# Altium schematic sheet 10_HDMI_OUT.SchDoc
size A3
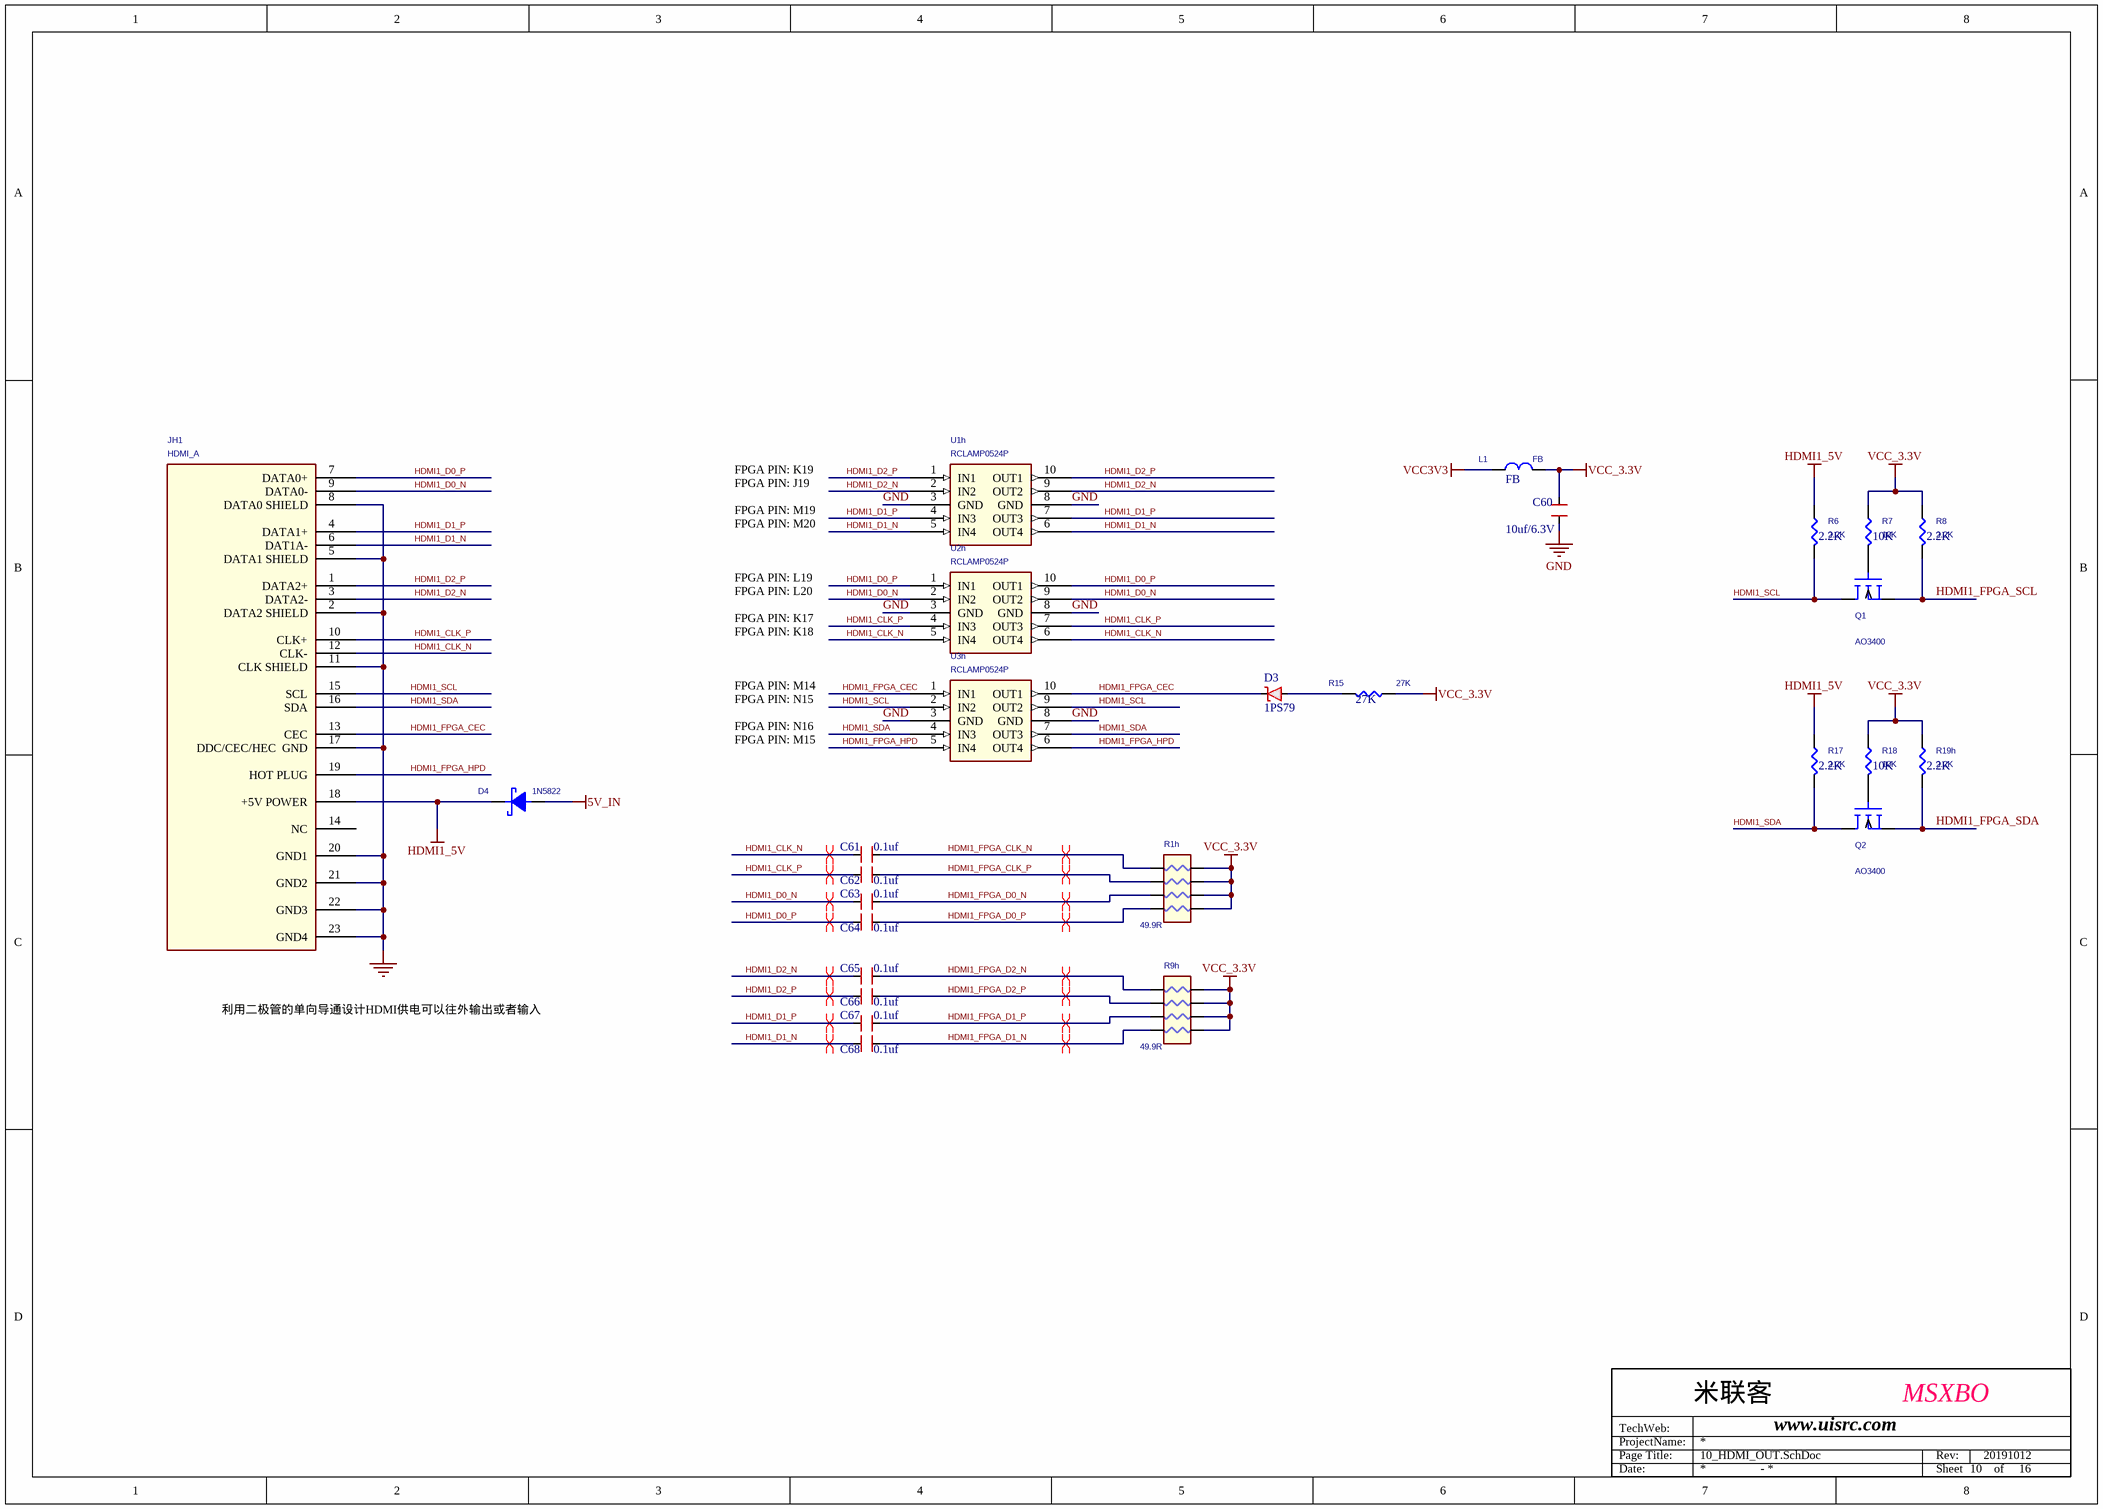
[diagram p0: 10_HDMI_OUT.SchDoc]

## Parts
C60  10uf/6.3V  [CAP0805]
C61  0.1uf  [CAP0402]
C62  0.1uf  [CAP0402]
C63  0.1uf  [CAP0402]
C64  0.1uf  [CAP0402]
C65  0.1uf  [CAP0402]
C66  0.1uf  [CAP0402]
C67  0.1uf  [CAP0402]
C68  0.1uf  [CAP0402]
D3  1PS79  [SOD-523]
D4  1N5822  [SMA_DO_214AC]
JH1  HDMI_A  [HDMI_1903015]
L1  FB  [CAP0603]
Q1  AO3400  [SOT23]
Q2  AO3400  [SOT23]
R1h  49.9R  [RA4_0603]
R6  2.2K  [RES0402]
R7  10K  [RES0402]
R8  2.2K  [RES0402]
R9h  49.9R  [RA4_0603]
R15  27K  [RES0402]
R17  2.2K  [RES0402]
R18  10K  [RES0402]
R19h  2.2K  [RES0402]
U1h  RCLAMP0524P  [SLP2510P8_10]
U2h  RCLAMP0524P  [SLP2510P8_10]
U3h  RCLAMP0524P  [SLP2510P8_10]

## Nets
5V_IN: D4.1(A)
GND: C60.2 JH1.2(DATA2_SHIELD) JH1.5(DATA1_SHIELD) JH1.8(DATA0_SHIELD) JH1.11(CLK_SHIELD) JH1.17(DDC/CEC/HEC__GND) JH1.20(GND1) JH1.21(GND2) JH1.22(GND3) JH1.23(GND4) U1h.3(GND) U1h.8(GND) U2h.3(GND) U2h.8(GND) U3h.3(GND) U3h.8(GND)
HDMI1_5V: D4.2(C) JH1.18(+5V_POWER) R6.2 R17.2
VCC3V3: L1.1
VCC_3.3V: C60.1 L1.2 R1h.1 R1h.2 R1h.3 R1h.4 R7.2 R8.2 R9h.1 R9h.2 R9h.3 R9h.4 R15.2 R18.2 R19h.2
HDMI1_CLK_N: C61.1 JH1.12(CLK-) U2h.5(IN4) U2h.6(OUT4)
HDMI1_CLK_P: C62.1 JH1.10(CLK+) U2h.4(IN3) U2h.7(OUT3)
HDMI1_D0_N: C63.1 JH1.9(DATA0-) U2h.2(IN2) U2h.9(OUT2)
HDMI1_D0_P: C64.1 JH1.7(DATA0+) U2h.1(IN1) U2h.10(OUT1)
HDMI1_D1_N: C68.1 JH1.6(DAT1A-) U1h.5(IN4) U1h.6(OUT4)
HDMI1_D1_P: C67.1 JH1.4(DATA1+) U1h.4(IN3) U1h.7(OUT3)
HDMI1_D2_N: C65.1 JH1.3(DATA2-) U1h.2(IN2) U1h.9(OUT2)
HDMI1_D2_P: C66.1 JH1.1(DATA2+) U1h.1(IN1) U1h.10(OUT1)
HDMI1_FPGA_CEC: D3.K JH1.13(CEC) U3h.1(IN1) U3h.10(OUT1)
HDMI1_FPGA_CLK_N: C61.2 R1h.8
HDMI1_FPGA_CLK_P: C62.2 R1h.7
HDMI1_FPGA_D0_N: C63.2 R1h.6
HDMI1_FPGA_D0_P: C64.2 R1h.5
HDMI1_FPGA_D1_N: C68.2 R9h.5
HDMI1_FPGA_D1_P: C67.2 R9h.6
HDMI1_FPGA_D2_N: C65.2 R9h.8
HDMI1_FPGA_D2_P: C66.2 R9h.7
HDMI1_FPGA_HPD: JH1.19(HOT_PLUG) U3h.5(IN4) U3h.6(OUT4)
HDMI1_FPGA_SCL: Q1.2(S) R8.1
HDMI1_FPGA_SDA: Q2.2(S) R19h.1
HDMI1_SCL: JH1.15(SCL) Q1.3(D) R6.1 U3h.2(IN2) U3h.9(OUT2)
HDMI1_SDA: JH1.16(SDA) Q2.3(D) R17.1 U3h.4(IN3) U3h.7(OUT3)
NetD3_A: D3.A R15.1
NetQ1_1: Q1.1(G) R7.1
NetQ2_1: Q2.1(G) R18.1

Not connected (* = marked no-connect by the designer): JH1 14(NC)

## Layout directives
differential pair: HDMI1_CLK_N, HDMI1_CLK_P, HDMI1_D0_N, HDMI1_D0_P, HDMI1_D1_N, HDMI1_D1_P, HDMI1_D2_N, HDMI1_D2_P, HDMI1_FPGA_CLK_N, HDMI1_FPGA_CLK_P, HDMI1_FPGA_D0_N, HDMI1_FPGA_D0_P, HDMI1_FPGA_D1_N, HDMI1_FPGA_D1_P, HDMI1_FPGA_D2_N, HDMI1_FPGA_D2_P

## Notes on the sheet
- FPGA PIN: K19
- FPGA PIN: J19
- FPGA PIN: M19
- FPGA PIN: M20
- FPGA PIN: L19
- FPGA PIN: L20
- FPGA PIN: K17
- FPGA PIN: K18
- FPGA PIN: M14
- FPGA PIN: N15
- FPGA PIN: N16
- FPGA PIN: M15
- 利用二极管的单向导通设计HDMI供电可以往外输出或者输入
- ProjectName:
- TechWeb:
- Page Title:
- 米联客
- www.uisrc.com
- MSXBO
- Rev:
- 20191012
- Date:
- -
- Sheet
- 10    of     16

## Library data of the parts
C60 = CAPACITOR: Generic Capacitor; Value: 4.7uF; DPN: *; Manufacturer: *
C61-C68 = C0402
D3 = DIODE-SCH: Schotkey Diode NOT GENERIC; DPN: *; Manufacturer: *
D4 = 1N5817
L1 = INDUCTOR1: TC2: 0; DIELECTRIC: DSMAX; CURRENT: LMAX; PSpiceTemplate: L^@REFDES %1 %2 ?TOLERANCE|L^@REFDES| @VALUE ?IC/IC=@IC/ ?TOLERANCE|\n.model l^@REFDES IND L=1 DEV=@TOLERANCE% TC1=@TC1 TC2=@TC2 IL1=@IL1 IL2=@IL2|; DIST: FLAT; TC1: 0; IL2: 0; IL1: 0; Value: FB
Q1 Q2 = AO3400: PSpiceTemplate: X^@REFDES %d %g %s @MODEL
R1h R9h = RA-4
R6-R8 R15 R17 R18 R19h = RES1: DIST: FLAT; PSpiceTemplate: R^@REFDES %1 %2 ?TOLERANCE|R^@REFDES| @VALUE TC=@TC1,@TC2 ?TOLERANCE|\n.model R^@REFDES RES R=1 DEV=@TOLERANCE% TC1=@TC1 TC2=@TC2|; VOLTAGE: RVMAX; SLOPE: RSMAX; MAX_TEMP: RTMAX; POWER: RMAX; TC1: 0; TC2: 0
  R6 R8 R17 R19h: Value: 2.2K
  R7 R18: Value: 10K
  R15: Value: 27K